# Altium schematic sheet Connectors_ADC.SchDoc
size A4; SheetNumber: 2; SheetTotal: 6; SPICEModelCacheCWWNLBKH: <root> / <DocumentId>CWWNLBKH</DocumentId> / <CacheFrame Number="0"> / <Model Name="0603_885012206071_100nf" Kind="CKT"> / <Text>******* / .subckt 0603_885012206071_100nF 1 2 / Rser 1 3 0.025 / Lser 2 4 0.0000000008 / C1 3 4 0.0000001 / Rpar 3 4 5000000000 / .ends 0603_885012206071_100nF</Text> / </Model> / </CacheFrame> / </root>
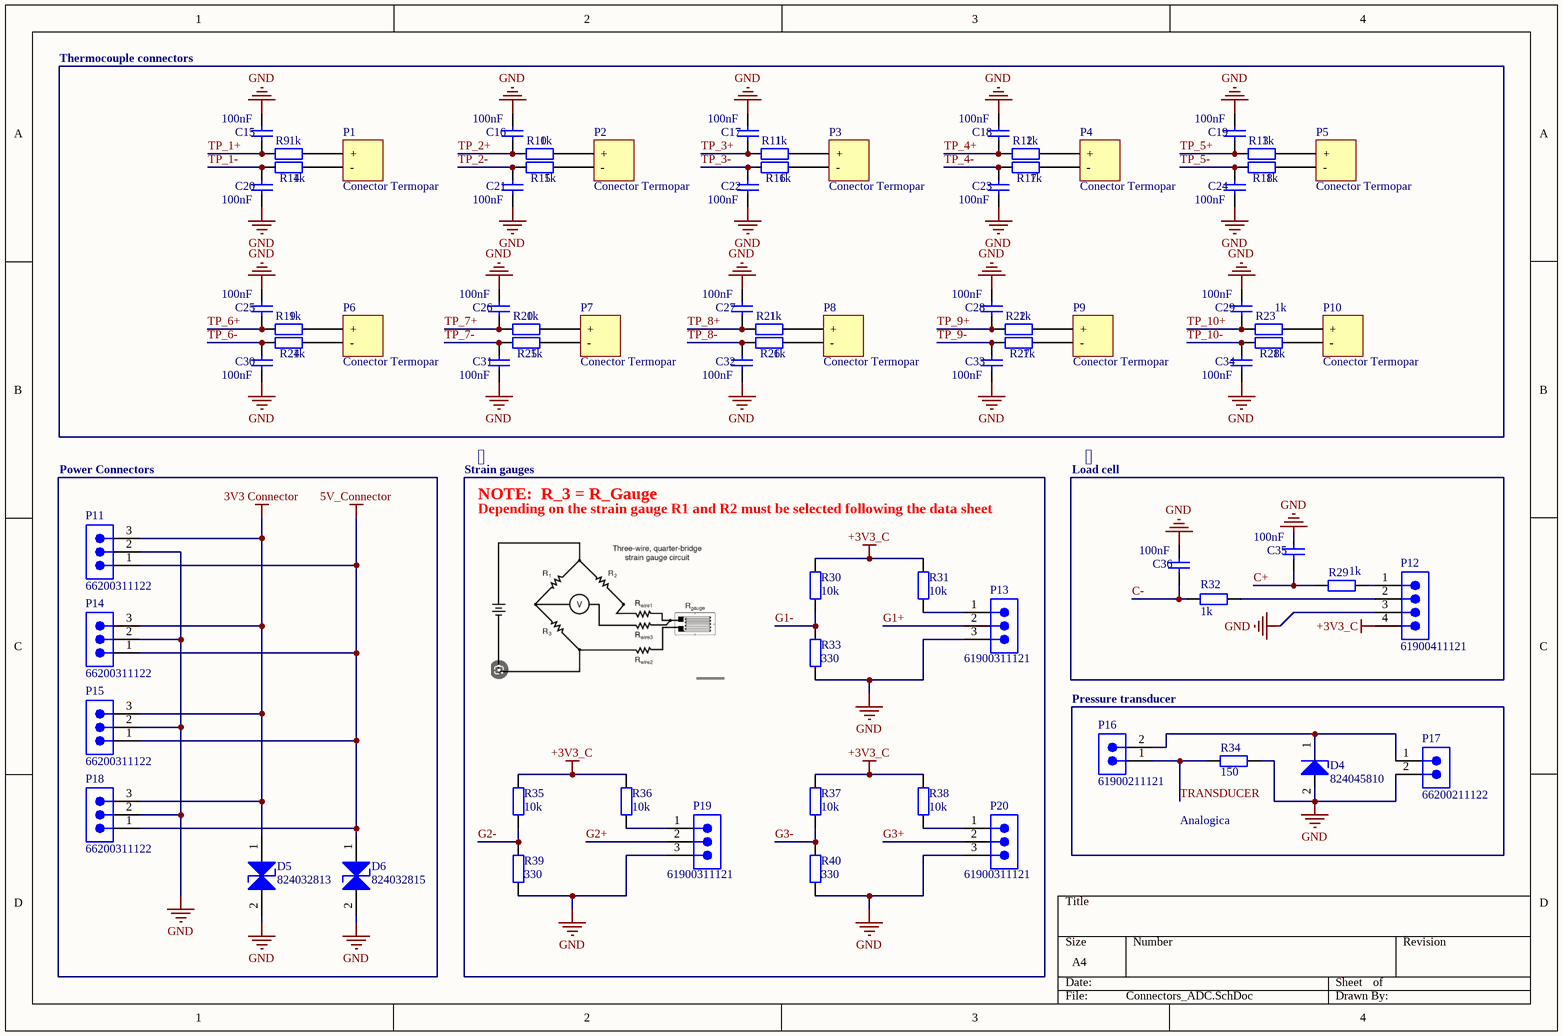
[diagram p0: Connectors_ADC.SchDoc]

## Parts
C15  value 100nF  [WCAP-CSGP_0603_L1.6W0.8H0.8_Reflow]  (hidden comment: 885012206071)
C16  value 100nF  [WCAP-CSGP_0603_L1.6W0.8H0.8_Reflow]  (hidden comment: 885012206071)
C17  value 100nF  [WCAP-CSGP_0603_L1.6W0.8H0.8_Reflow]  (hidden comment: 885012206071)
C18  value 100nF  [WCAP-CSGP_0603_L1.6W0.8H0.8_Reflow]  (hidden comment: 885012206071)
C19  value 100nF  [WCAP-CSGP_0603_L1.6W0.8H0.8_Reflow]  (hidden comment: 885012206071)
C20  value 100nF  [WCAP-CSGP_0603_L1.6W0.8H0.8_Reflow]  (hidden comment: 885012206071)
C21  value 100nF  [WCAP-CSGP_0603_L1.6W0.8H0.8_Reflow]  (hidden comment: 885012206071)
C22  value 100nF  [WCAP-CSGP_0603_L1.6W0.8H0.8_Reflow]  (hidden comment: 885012206071)
C23  value 100nF  [WCAP-CSGP_0603_L1.6W0.8H0.8_Reflow]  (hidden comment: 885012206071)
C24  value 100nF  [WCAP-CSGP_0603_L1.6W0.8H0.8_Reflow]  (hidden comment: 885012206071)
C25  value 100nF  [WCAP-CSGP_0603_L1.6W0.8H0.8_Reflow]  (hidden comment: 885012206071)
C26  value 100nF  [WCAP-CSGP_0603_L1.6W0.8H0.8_Reflow]  (hidden comment: 885012206071)
C27  value 100nF  [WCAP-CSGP_0603_L1.6W0.8H0.8_Reflow]  (hidden comment: 885012206071)
C28  value 100nF  [WCAP-CSGP_0603_L1.6W0.8H0.8_Reflow]  (hidden comment: 885012206071)
C29  value 100nF  [WCAP-CSGP_0603_L1.6W0.8H0.8_Reflow]  (hidden comment: 885012206071)
C30  value 100nF  [WCAP-CSGP_0603_L1.6W0.8H0.8_Reflow]  (hidden comment: 885012206071)
C31  value 100nF  [WCAP-CSGP_0603_L1.6W0.8H0.8_Reflow]  (hidden comment: 885012206071)
C32  value 100nF  [WCAP-CSGP_0603_L1.6W0.8H0.8_Reflow]  (hidden comment: 885012206071)
C33  value 100nF  [WCAP-CSGP_0603_L1.6W0.8H0.8_Reflow]  (hidden comment: 885012206071)
C34  value 100nF  [WCAP-CSGP_0603_L1.6W0.8H0.8_Reflow]  (hidden comment: 885012206071)
C35  value 100nF  [WCAP-CSGP_0603_L1.6W0.8H0.8_Reflow]  (hidden comment: 885012206071)
C36  value 100nF  [WCAP-CSGP_0603_L1.6W0.8H0.8_Reflow]  (hidden comment: 885012206071)
D4  824045810  [WE-TVS_DFN1610-2L]
D5  824032813  [WE-TVS_DFN1610-2L]
D6  824032815  [WE-TVS_DFN1610-2L]
P1  Conector Termopar  [New footprint 1]
P2  Conector Termopar  [New footprint 1]
P3  Conector Termopar  [New footprint 1]
P4  Conector Termopar  [New footprint 1]
P5  Conector Termopar  [New footprint 1]
P6  Conector Termopar  [New footprint 1]
P7  Conector Termopar  [New footprint 1]
P8  Conector Termopar  [New footprint 1]
P9  Conector Termopar  [New footprint 1]
P10  Conector Termopar  [New footprint 1]
P11  66200311122  [66200311122]
P12  61900411121  [61900411121]
P13  61900311121  [61900311121]
P14  66200311122  [66200311122]
P15  66200311122  [66200311122]
P16  61900211121  [61900211121]
P17  66200211122  [66200211122]
P18  66200311122  [66200311122]
P19  61900311121  [61900311121]
P20  61900311121  [61900311121]
R9  value 1k  [WRIS-RSKS_0603_Reflow]  (hidden comment: 560112116014)
R10  value 1k  [WRIS-RSKS_0603_Reflow]  (hidden comment: 560112116014)
R11  value 1k  [WRIS-RSKS_0603_Reflow]  (hidden comment: 560112116014)
R12  value 1k  [WRIS-RSKS_0603_Reflow]  (hidden comment: 560112116014)
R13  value 1k  [WRIS-RSKS_0603_Reflow]  (hidden comment: 560112116014)
R14  value 1k  [WRIS-RSKS_0603_Reflow]  (hidden comment: 560112116014)
R15  value 1k  [WRIS-RSKS_0603_Reflow]  (hidden comment: 560112116014)
R16  value 1k  [WRIS-RSKS_0603_Reflow]  (hidden comment: 560112116014)
R17  value 1k  [WRIS-RSKS_0603_Reflow]  (hidden comment: 560112116014)
R18  value 1k  [WRIS-RSKS_0603_Reflow]  (hidden comment: 560112116014)
R19  value 1k  [WRIS-RSKS_0603_Reflow]  (hidden comment: 560112116014)
R20  value 1k  [WRIS-RSKS_0603_Reflow]  (hidden comment: 560112116014)
R21  value 1k  [WRIS-RSKS_0603_Reflow]  (hidden comment: 560112116014)
R22  value 1k  [WRIS-RSKS_0603_Reflow]  (hidden comment: 560112116014)
R23  value 1k  [WRIS-RSKS_0603_Reflow]  (hidden comment: 560112116014)
R24  value 1k  [WRIS-RSKS_0603_Reflow]  (hidden comment: 560112116014)
R25  value 1k  [WRIS-RSKS_0603_Reflow]  (hidden comment: 560112116014)
R26  value 1k  [WRIS-RSKS_0603_Reflow]  (hidden comment: 560112116014)
R27  value 1k  [WRIS-RSKS_0603_Reflow]  (hidden comment: 560112116014)
R28  value 1k  [WRIS-RSKS_0603_Reflow]  (hidden comment: 560112116014)
R29  value 1k  [WRIS-RSKS_0603_Reflow]  (hidden comment: 560112116014)
R30  value 10k  [WRIS-RSKS_0603_Reflow]  (hidden comment: 560112116005)
R31  value 10k  [WRIS-RSKS_0603_Reflow]  (hidden comment: 560112116005)
R32  value 1k  [WRIS-RSKS_0603_Reflow]  (hidden comment: 560112116014)
R33  value 330  [WRIS-RSKS_0603_Reflow]  (hidden comment: 560112116020)
R34  value 150  [WRIS-RSKS_0603_Reflow]  (hidden comment: 560112116041)
R35  value 10k  [WRIS-RSKS_0603_Reflow]  (hidden comment: 560112116005)
R36  value 10k  [WRIS-RSKS_0603_Reflow]  (hidden comment: 560112116005)
R37  value 10k  [WRIS-RSKS_0603_Reflow]  (hidden comment: 560112116005)
R38  value 10k  [WRIS-RSKS_0603_Reflow]  (hidden comment: 560112116005)
R39  value 330  [WRIS-RSKS_0603_Reflow]  (hidden comment: 560112116020)
R40  value 330  [WRIS-RSKS_0603_Reflow]  (hidden comment: 560112116020)

## Blocks framed on the sheet
Thermocouple connectors: C15-C34 P1-P10 R9-R28
Power Connectors: D5 D6 P11 P14 P15 P18
: P13 P19 P20 R30 R31 R33 R35-R40
: C35 C36 P12 R29 R32

## Nets
3V3 Connector: D5.1(I/O_1) P11.3 P14.3 P15.3 P18.3
5V_Connector: D6.1(I/O_1) P11.1 P14.1 P15.1 P18.1
+3V3_C: P12.4 R30.2 R31.2 R35.2 R36.2 R37.2 R38.2
GND: C15.2 C16.2 C17.2 C18.2 C19.2 C20.1 C21.1 C22.1 C23.1 C24.1 C25.2 C26.2 C27.2 C28.2 C29.2 C30.1 C31.1 C32.1 C33.1 C34.1 C35.2 C36.2 D4.2(GND) D5.2(GND) D6.2(GND) P11.2 P12.3 P13.3 P14.2 P15.2 P17.2 P18.2 P19.3 P20.3 R33.1 R34.1 R39.1 R40.1
C+: C35.1 R29.1
C-: C36.1 R32.1
G1+: P13.2
G1-: R30.1 R33.2
G2+: P19.2
G2-: R35.1 R39.2
G3+: P20.2
G3-: R37.1 R40.2
TP_1+: C15.1 R9.1
TP_1-: C20.2 R14.1
TP_2+: C16.1 R10.1
TP_2-: C21.2 R15.1
TP_3+: C17.1 R11.1
TP_3-: C22.2 R16.1
TP_4+: C18.1 R12.1
TP_4-: C23.2 R17.1
TP_5+: C19.1 R13.1
TP_5-: C24.2 R18.1
TP_6+: C25.1 R19.1
TP_6-: C30.2 R24.1
TP_7+: C26.1 R20.1
TP_7-: C31.2 R25.1
TP_8+: C27.1 R21.1
TP_8-: C32.2 R26.1
TP_9+: C28.1 R22.1
TP_9-: C33.2 R27.1
TP_10+: C29.1 R23.1
TP_10-: C34.2 R28.1
TRANSDUCER: P16.1 R34.2
NetD4_1: D4.1(I/O_1) P16.2 P17.1
NetP1_1: P1.1(+) R9.2
NetP1_2: P1.2(-) R14.2
NetP2_1: P2.1(+) R10.2
NetP2_2: P2.2(-) R15.2
NetP3_1: P3.1(+) R11.2
NetP3_2: P3.2(-) R16.2
NetP4_1: P4.1(+) R12.2
NetP4_2: P4.2(-) R17.2
NetP5_1: P5.1(+) R13.2
NetP5_2: P5.2(-) R18.2
NetP6_1: P6.1(+) R19.2
NetP6_2: P6.2(-) R24.2
NetP7_1: P7.1(+) R20.2
NetP7_2: P7.2(-) R25.2
NetP8_1: P8.1(+) R21.2
NetP8_2: P8.2(-) R26.2
NetP9_1: P9.1(+) R22.2
NetP9_2: P9.2(-) R27.2
NetP10_1: P10.1(+) R23.2
NetP10_2: P10.2(-) R28.2
NetP12_1: P12.1 R29.2
NetP12_2: P12.2 R32.2
NetP13_1: P13.1 R31.1
NetP19_1: P19.1 R36.1
NetP20_1: P20.1 R38.1

## Notes on the sheet
- Strain gauges
- NOTE:  R_3 = R_Gauge
- Depending on the strain gauge R1 and R2 must be selected following the data sheet
- Load cell
- Pressure transducer
- Analogica

## Library data of the parts
C15-C36 = CMP-001-00661-1: WCAP-CSGP Multilayer Ceramic Chip Capacitor, General Purpose, size 0603, X7R, 100nF, 25VDC; Manufacturer: Wurth Elektronik; Dissipation Factor: 3.5%; Capacitance Tolerance: +/-10%; Insulation Resistance: 5GOhm; Technical Reference: X7R0603104K025DFCT10000; Rated Voltage (DC): 25V; Packaging: Tape and Reel; Height: 0.8mm; Mount: Surface Mount; Source: WCAP-CSGP.SchLib; Component Type: Standard; Category: Multilayer Ceramic Chip Capacitors; Operating Temperature Min: -55°C; Case/Package: 0603; ComponentLink2Description: Datasheet Link; Width: 0.8mm; ComponentLink1URL: https://www.we-online.com/redexpert/article/885012206071?ad; Length: 1.6mm; Operating Temperature Max: 125°C; Match Code: WCAP-CSGP; ComponentLink2URL: https://www.we-online.com/redexpert/spec/885012206071?ad; Design Item ID: 885012206071; ComponentLink1Description: Website Link; Manufacturer Part Number: 885012206071; Pins: 2; Ceramic Type: X7R
D4 = CMP-004-00054-1: WE-TVS TVS Diode – Standard Series, DFN1610-2L, 1 Channel, 20V, 240pF; Manufacturer: Wurth Elektronik; Channel ESD Clamping Voltage: 25.5V; Channel Reverse Leakage Current: 1uA; ESD Air Discharge Capability: 30kV; (Reverse) Breakdown Voltage: 22.8V; Polarity: Unidirectional; (Reverse) Peak Pulse Current: 24A; Number of Channels: 1; Length: 1.6mm; Operating Temperature Max: 85°C; Case/Package: DFN1610-2L; Design Item ID: 824045810; ComponentLink2URL: https://www.we-online.com/redexpert/spec/824045810?ad; ComponentLink1URL: https://www.we-online.com/redexpert/article/824045810?ad; Height: 0.5mm; Channel Input Capacitance: 240pF; Component Type: Standard; Match Code: WE-TVS; Operating Temperature Min: -55°C; ComponentLink2Description: Datasheet Link; Source: WE-TVS.SchLib; Manufacturer Part Number: 824045810; Channel Operating Voltage: 20V; Pins: 2; Mount: Surface Mount; Packaging: Tape and Reel; Category: ESD Protection; ComponentLink1Description: Website Link; ESD Contact Discharge Capability: 30kV; Width: 1mm
D5 = CMP-03913-133963840-1: 824032813 Tvs Diode, Bidir, 3.3V, Dfn1610 Rohs Compliant: Yes; Width: 1mm; NexarPartId: 133963840; Min Operating Temperature: -55°C; Max Operating Temperature: 125°C; Height: 500µm; Length: 1.6mm; RoHS: Compliant
D6 = CMP-03913-133963841-1: 824032815 Tvs Diode, Bidir, 5V, Dfn1610 Rohs Compliant: Yes; Min Operating Temperature: -55°C; Width: 1mm; NexarPartId: 133963841; Length: 1.6mm; RoHS: Compliant; Max Operating Temperature: 85°C; Height: 500µm
P1-P10 = CMP-002-00006-3: Conector para termopar vertical (hembra)
P11 P14 P15 P18 = CMP-002-00024-2: WR-MPC3 THT Male Vertical Header, pitch 3mm, 3p; Manufacturer: Wurth Elektronik; Working Voltage: 250V (AC); Rated Current: 5A; Insulation Resistance: >1000MOhm; Contact Resistance: 10mOhm; Manufacturer Part Number: 66200311122; Operating Temperature Max: 105°C; Mount: Through Hole; ComponentLink1Description: Website Link; Operating Temperature Min: -40°C; Design Item ID: 66200311122; ComponentLink2Description: Datasheet Link; Number of Rows: 1; Pitch: 3mm; ComponentLink2URL: https://www.we-online.com/redexpert/spec/66200311122?ad; Gender: Male; Length: 12.65mm; Orientation: Vertical; Component Type: Standard; Pin Count: 3; Packaging: Tube; Width: 5.57mm; ComponentLink1URL: https://www.we-online.com/redexpert/article/66200311122?ad; Height: 11mm; Pins: 3; Source: WR-MPC3.SchLib; Category: Wire-to-Board Connectors; Match Code: WR-MPC3
P12 = CMP-002-00293-1: WR-WTB THT Male Vertical Locking Header, pitch 2.54mm, 4pins; Manufacturer: Wurth Elektronik; Working Voltage: 250VAC; Withstanding Voltage: 1000VAC; Contact Resistance: 20mOhm; Rated Current: 3A; Manufacturer Part Number: 61900411121; Design Item ID: 61900411121; ComponentLink2Description: Datasheet Link; Width: 5.8mm; Operating Temperature Min: -40°C; Number of Rows: 1; Pins: 4; Pitch: 2.54mm; Height: 11.5mm; Gender: Male; Component Type: Standard; ComponentLink2URL: https://www.we-online.com/redexpert/spec/61900411121?ad; Mount: Through Hole; Length: 10.16mm; ComponentLink1URL: https://www.we-online.com/redexpert/article/61900411121?ad; Packaging: Bag; Operating Temperature Max: 105°C; Pin Count: 4; Category: Wire-to-Board Connectors; Source: WR-WTB.SchLib; Orientation: Vertical; Match Code: WR-WTB; ComponentLink1Description: Website Link
P13 P19 P20 = CMP-002-00290-1: WR-WTB THT Male Vertical Locking Header, pitch 2.54mm, 3pins; Manufacturer: Wurth Elektronik; Rated Current: 3A; Working Voltage: 250VAC; Contact Resistance: 20mOhm; Withstanding Voltage: 1000VAC; Match Code: WR-WTB; Component Type: Standard; Operating Temperature Max: 105°C; ComponentLink2Description: Datasheet Link; Gender: Male; Width: 5.8mm; Pitch: 2.54mm; Mount: Through Hole; Manufacturer Part Number: 61900311121; Operating Temperature Min: -40°C; ComponentLink1Description: Website Link; Source: WR-WTB.SchLib; Height: 11.5mm; Pins: 3; Design Item ID: 61900311121; ComponentLink1URL: https://www.we-online.com/redexpert/article/61900311121?ad; Length: 7.62mm; Pin Count: 3; Number of Rows: 1; Orientation: Vertical; Category: Wire-to-Board Connectors; ComponentLink2URL: https://www.we-online.com/redexpert/spec/61900311121?ad; Packaging: Bag
P16 = CMP-002-00287-1: WR-WTB THT Male Vertical Locking Header, pitch 2.54mm, 2pins; Manufacturer: Wurth Elektronik; Withstanding Voltage: 1000VAC; Rated Current: 3A; Working Voltage: 250VAC; Contact Resistance: 20mOhm; Match Code: WR-WTB; Height: 11.5mm; Pin Count: 2; Pitch: 2.54mm; Category: Wire-to-Board Connectors; Orientation: Vertical; Length: 5.08mm; ComponentLink1Description: Website Link; Manufacturer Part Number: 61900211121; Operating Temperature Max: 105°C; Component Type: Standard; Source: WR-WTB.SchLib; Width: 5.8mm; ComponentLink1URL: https://www.we-online.com/redexpert/article/61900211121?ad; Packaging: Bag; ComponentLink2URL: https://www.we-online.com/redexpert/spec/61900211121?ad; Number of Rows: 1; Pins: 2; Design Item ID: 61900211121; Operating Temperature Min: -40°C; Gender: Male; ComponentLink2Description: Datasheet Link; Mount: Through Hole
P17 = CMP-002-00010-2: WR-MPC3 THT Male Vertical Header, pitch 3mm, 2p; Manufacturer: Wurth Elektronik; Insulation Resistance: >1000MOhm; Rated Current: 5A; Contact Resistance: 10mOhm; Working Voltage: 250V (AC); Height: 11mm; Packaging: Tube; Component Type: Standard; Operating Temperature Max: 105°C; Manufacturer Part Number: 66200211122; Design Item ID: 66200211122; Number of Rows: 1; Mount: Through Hole; Source: WR-MPC3.SchLib; Category: Wire-to-Board Connectors; Pitch: 3mm; ComponentLink1URL: https://www.we-online.com/redexpert/article/66200211122?ad; Pin Count: 2; Match Code: WR-MPC3; Width: 5.57mm; Operating Temperature Min: -40°C; ComponentLink1Description: Website Link; Orientation: Vertical; Gender: Male; ComponentLink2URL: https://www.we-online.com/redexpert/spec/66200211122?ad; Length: 9.65mm; Pins: 2; ComponentLink2Description: Datasheet Link
R9-R29 R32 = CMP-009-00337-1: WRIS-RSKS Thick Film Resistor, size 0603, 1000Ohm, 100mW; Manufacturer: Wurth Elektronik; Resistance Tolerance: +/-1%; Limiting Element Voltage: 75V; Temperature Coefficient of Resistance Min: -100ppm/°C; Temperature Coefficient of Resistance Max: 100ppm/°C; Mount: Surface Mount; Rated Power: 100mW; Packaging: Tape and Reel; Case/Package: 0603; ComponentLink1URL: https://www.we-online.com/redexpert/article/560112116014?ad; Height: 0.45mm; Manufacturer Part Number: 560112116014; ComponentLink1Description: Website Link; ComponentLink2URL: https://www.we-online.com/redexpert/spec/560112116014?ad; Source: WRIS-RSKS.SchLib; Operating Temperature Min: -55°C; Width: 0.8mm; Match Code: WRIS-RSKS; Design Item ID: 560112116014; ComponentLink2Description: Datasheet Link; Category: Thick Film Resistors; Operating Temperature Max: 155°C; Component Type: Standard; Length: 1.6mm; Pins: 2
R30 R31 R35-R38 = CMP-009-00328-1: WRIS-RSKS Thick Film Resistor, size 0603, 10000Ohm, 100mW; Manufacturer: Wurth Elektronik; Limiting Element Voltage: 75V; Temperature Coefficient of Resistance Max: 100ppm/°C; Resistance Tolerance: +/-1%; Temperature Coefficient of Resistance Min: -100ppm/°C; ComponentLink1Description: Website Link; Case/Package: 0603; Pins: 2; Match Code: WRIS-RSKS; Operating Temperature Max: 155°C; Width: 0.8mm; Design Item ID: 560112116005; Length: 1.6mm; ComponentLink2Description: Datasheet Link; ComponentLink2URL: https://www.we-online.com/redexpert/spec/560112116005?ad; Packaging: Tape and Reel; Source: WRIS-RSKS.SchLib; Height: 0.45mm; Manufacturer Part Number: 560112116005; Component Type: Standard; Mount: Surface Mount; Operating Temperature Min: -55°C; Rated Power: 100mW; ComponentLink1URL: https://www.we-online.com/redexpert/article/560112116005?ad; Category: Thick Film Resistors
R33 R39 R40 = CMP-009-00343-1: WRIS-RSKS Thick Film Resistor, size 0603, 330Ohm, 100mW; Manufacturer: Wurth Elektronik; Temperature Coefficient of Resistance Max: 100ppm/°C; Limiting Element Voltage: 75V; Resistance Tolerance: +/-1%; Temperature Coefficient of Resistance Min: -100ppm/°C; Component Type: Standard; ComponentLink1URL: https://www.we-online.com/redexpert/article/560112116020?ad; Rated Power: 100mW; Mount: Surface Mount; Category: Thick Film Resistors; Design Item ID: 560112116020; Manufacturer Part Number: 560112116020; Width: 0.8mm; Match Code: WRIS-RSKS; Source: WRIS-RSKS.SchLib; Packaging: Tape and Reel; Length: 1.6mm; ComponentLink2URL: https://www.we-online.com/redexpert/spec/560112116020?ad; Height: 0.45mm; Case/Package: 0603; ComponentLink1Description: Website Link; Operating Temperature Max: 155°C; Operating Temperature Min: -55°C; ComponentLink2Description: Datasheet Link; Pins: 2
R34 = CMP-009-00364-1: WRIS-RSKS Thick Film Resistor, size 0603, 150Ohm, 100mW; Manufacturer: Wurth Elektronik; Resistance Tolerance: +/-1%; Temperature Coefficient of Resistance Min: -100ppm/°C; Temperature Coefficient of Resistance Max: 100ppm/°C; Limiting Element Voltage: 75V; ComponentLink1URL: https://www.we-online.com/redexpert/article/560112116041?ad; Width: 0.8mm; Mount: Surface Mount; Length: 1.6mm; ComponentLink2Description: Datasheet Link; Operating Temperature Min: -55°C; Packaging: Tape and Reel; Case/Package: 0603; Source: WRIS-RSKS.SchLib; ComponentLink2URL: https://www.we-online.com/redexpert/spec/560112116041?ad; Component Type: Standard; Manufacturer Part Number: 560112116041; Design Item ID: 560112116041; Rated Power: 100mW; Pins: 2; ComponentLink1Description: Website Link; Operating Temperature Max: 155°C; Height: 0.45mm; Category: Thick Film Resistors; Match Code: WRIS-RSKS